# Altium schematic sheet Microcontroller.SchDoc
size A
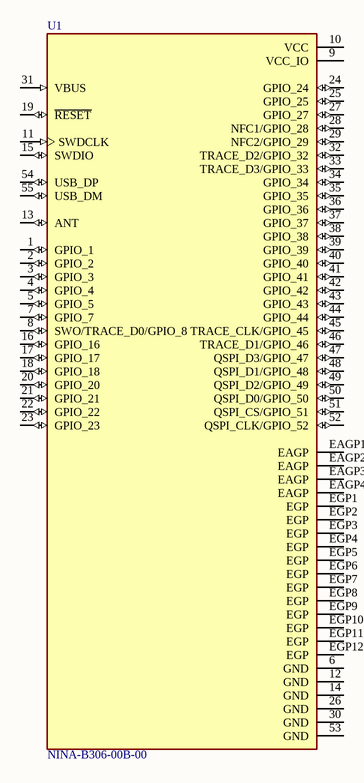
[diagram p0: Microcontroller.SchDoc]

## Parts
U1  NINA-B306-00B-00  [XCVR_NINA-B306-00B-00]

## Nets

Not connected (* = marked no-connect by the designer): U1 1(GPIO_1) 2(GPIO_2) 3(GPIO_3) 4(GPIO_4) 5(GPIO_5) 6(GND) 7(GPIO_7) 8(SWO/TRACE_D0/GPIO_8) 9(VCC_IO) 10(VCC) 11(SWDCLK) 12(GND) 13(ANT) 14(GND) 15(SWDIO) 16(GPIO_16) 17(GPIO_17) 18(GPIO_18) 19(~{RESET}) 20(GPIO_20) 21(GPIO_21) 22(GPIO_22) 23(GPIO_23) 24(GPIO_24) 25(GPIO_25) 26(GND) 27(GPIO_27) 28(NFC1/GPIO_28) 29(NFC2/GPIO_29) 30(GND) 31(VBUS) 32(TRACE_D2/GPIO_32) 33(TRACE_D3/GPIO_33) 34(GPIO_34) 35(GPIO_35) 36(GPIO_36) 37(GPIO_37) 38(GPIO_38) 39(GPIO_39) 40(GPIO_40) 41(GPIO_41) 42(GPIO_42) 43(GPIO_43) 44(GPIO_44) 45(TRACE_CLK/GPIO_45) 46(TRACE_D1/GPIO_46) 47(QSPI_D3/GPIO_47) 48(QSPI_D1/GPIO_48) 49(QSPI_D2/GPIO_49) 50(QSPI_D0/GPIO_50) 51(QSPI_CS/GPIO_51) 52(QSPI_CLK/GPIO_52) 53(GND) 54(USB_DP) 55(USB_DM) EAGP1(EAGP) EAGP2(EAGP) EAGP3(EAGP) EAGP4(EAGP) EGP1(EGP) EGP2(EGP) EGP3(EGP) EGP4(EGP) EGP5(EGP) EGP6(EGP) EGP7(EGP) EGP8(EGP) EGP9(EGP) EGP10(EGP) EGP11(EGP) EGP12(EGP)

## Library data of the parts
U1 = NINA-B306-00B-00: With internal PCB antenna, 10.0 x 15.0 x 2.2 mm, use with open CPU; MF: u-blox; Value: *; Package: SMD-55 u-blox; Price: None; MP: NINA-B306-00B-00; Availability: Unavailable; SnapEDA_Link: https://www.snapeda.com/parts/NINA-B306-00B-00/u-blox/view-part/4176731/?ref=snap